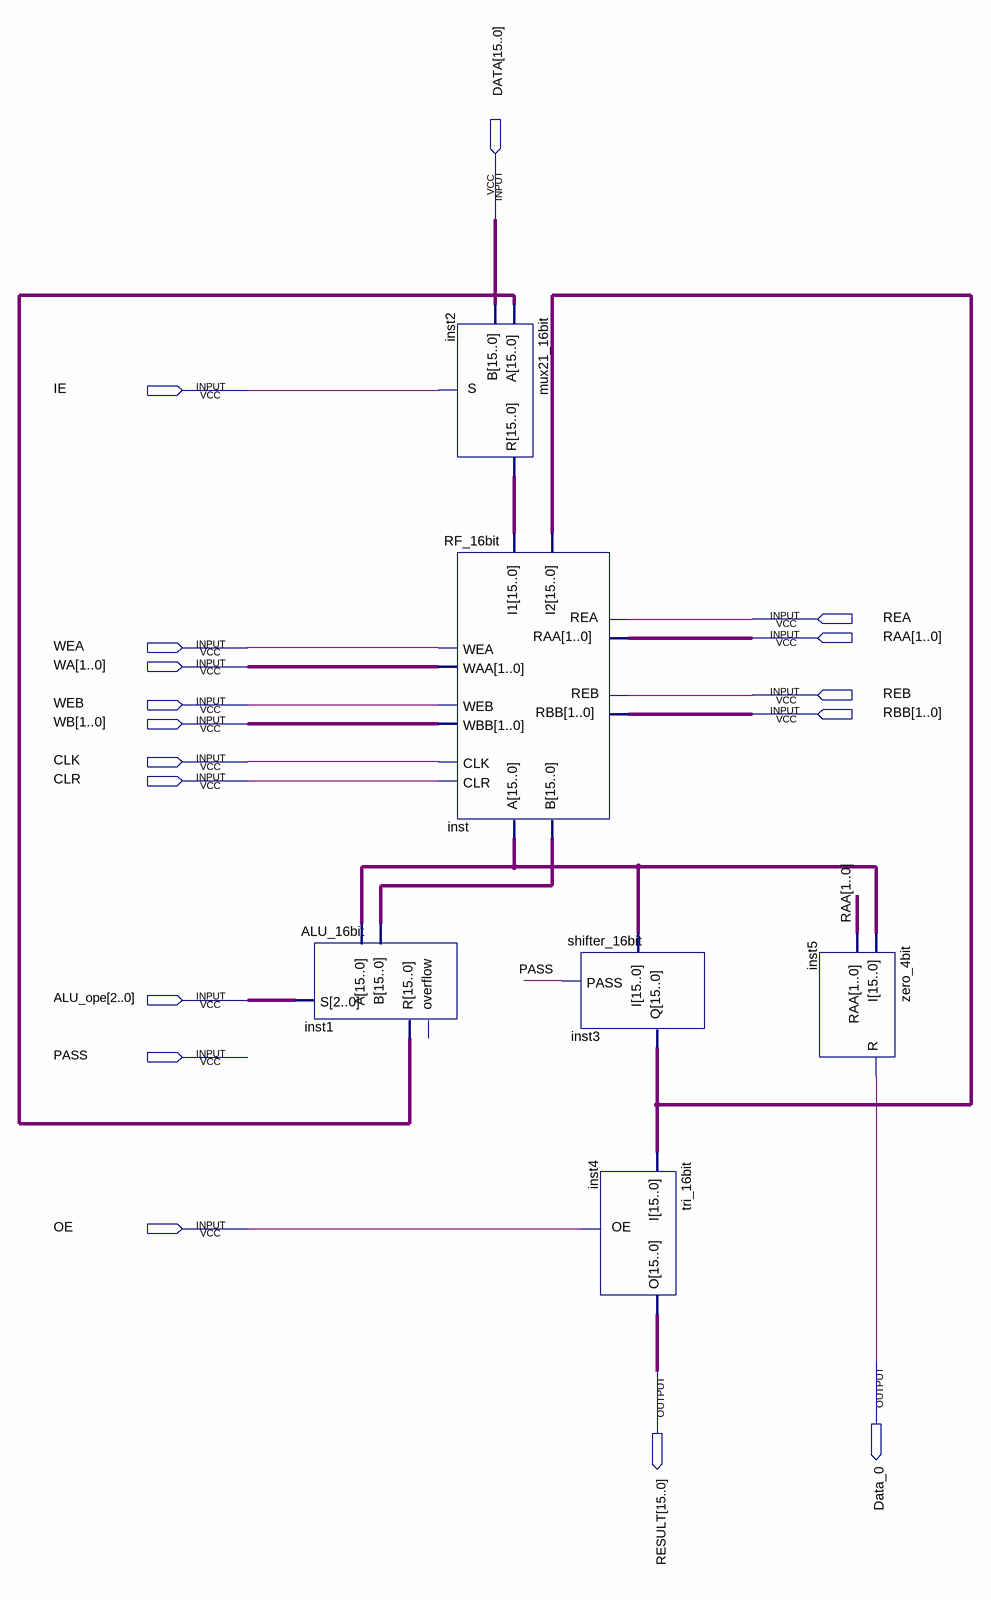
[diagram p0: schematic sheet]
// Quartus schematic datapath.bdf as structural Verilog: 6 symbols, 17 pins
module datapath (
  input  [15:0] DATA,
  input  IE,
  input  REA,
  input  [1:0] RAA,
  input  WEA,
  input  [1:0] WA,
  input  REB,
  input  WEB,
  input  [1:0] RBB,
  input  [1:0] WB,
  input  CLK,
  input  CLR,
  input  [2:0] ALU_ope,
  input  PASS,
  input  OE,
  output Data_0,
  output [15:0] RESULT
);

  wire [15:0] inst1_r, inst2_r, inst3_q, inst_a, inst_b;

  ALU_16bit inst1 (.A(inst_a), .B(inst_b), .S(ALU_ope), .R(inst1_r));  // open: overflow
  mux21_16bit inst2 (.A(inst1_r), .B(DATA), .S(IE), .R(inst2_r));
  RF_16bit inst (
    .I1(inst2_r), .I2(inst3_q), .REA(REA), .WEA(WEA), .RAA(RAA), .WAA(WA), .WEB(WEB), .WBB(WB), .CLK(CLK),
    .REB(REB), .RBB(RBB), .CLR(CLR), .A(inst_a), .B(inst_b));
  shifter_16bit inst3 (.I(inst_a), .PASS(PASS), .Q(inst3_q));
  tri_16bit inst4 (.I(inst3_q), .OE(OE), .O(RESULT));
  zero_4bit inst5 (.I(inst_a), .RAA(RAA), .R(Data_0));
endmodule
